# EAGLE design final2 (EAGLE 9.6.2)
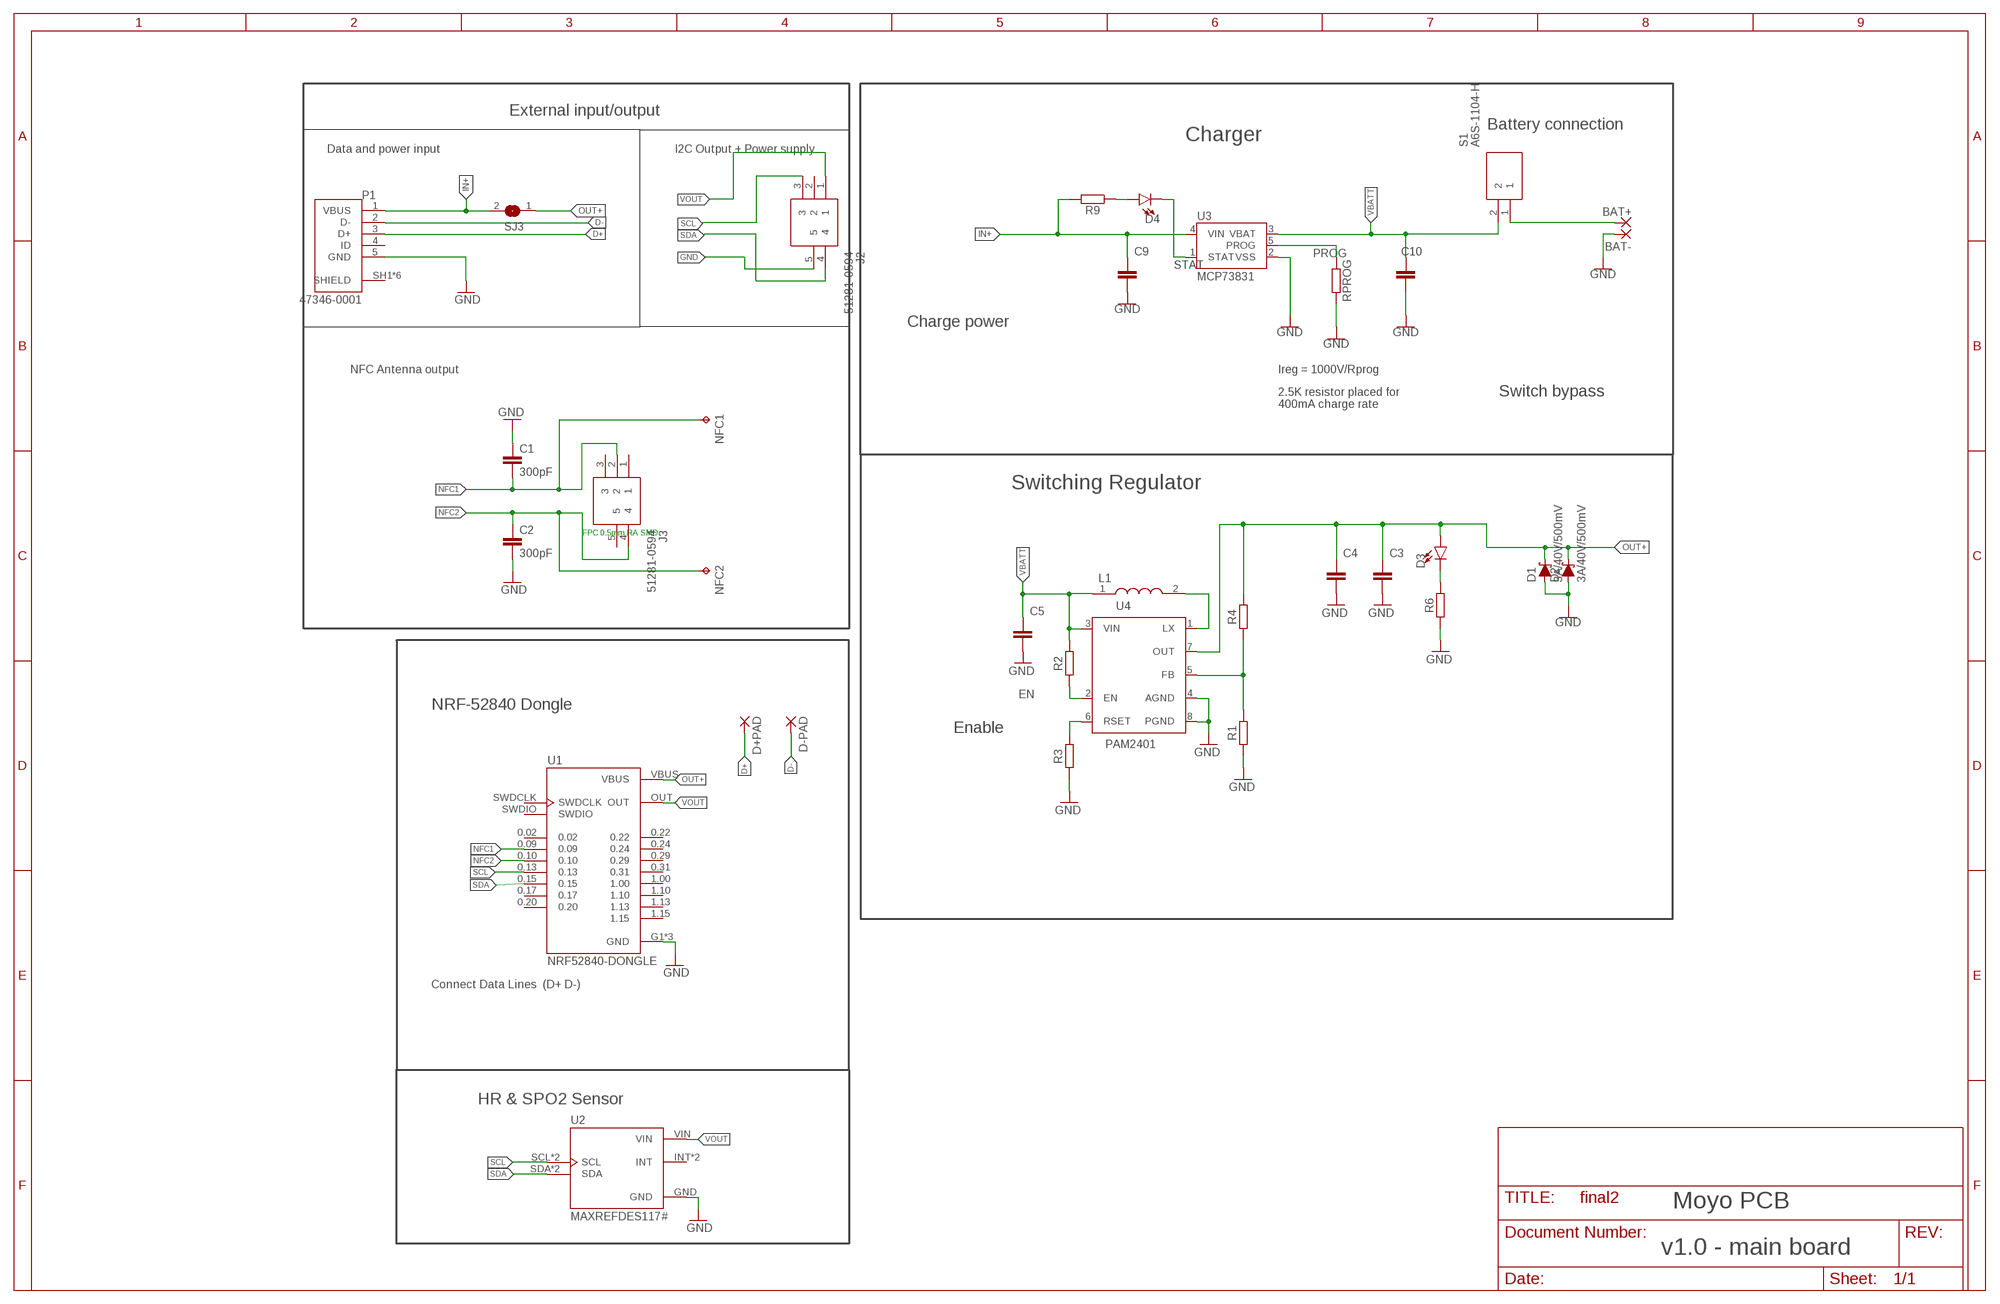
[diagram p0: schematic, sheet 1]

## Parts
BAT+  SMD5  [SMD2,54-5,08]
BAT-  SMD5  [SMD2,54-5,08]
C1  300pF  C-EUC0805  [C0805]
C2  300pF  C-EUC0805  [C0805]
C3  22uF  C-EUC0805  [C0805]
C4  22uF  C-EUC0805  [C0805]
C5  22uF  C-EUC0805  [C0805]
C9  4.7uF  C-EUC0805  [C0805]
C10  4.7uF  C-EUC0805  [C0805]
D1  3A/40V/500mV  DIODE-SCHOTTKY-B340A  [SMA-DIODE]
D2  3A/40V/500mV  DIODE-SCHOTTKY-B340A  [SMA-DIODE]
D3  RED  LEDCHIP-LED0805  [CHIP-LED0805]
D4  BLUE  LEDCHIP-LED0805  [CHIP-LED0805]
D+PAD  SMD5  [SMD2,54-5,08]
D-PAD  SMD5  [SMD2,54-5,08]
J2  51281-0594  [51281-0594]
J3  51281-0594  [51281-0594]
L1  74437324022  [WE-LHMI_402048]
NFC1  TPB1,27  [B1,27]
NFC2  TPB1,27  [B1,27]
P1  47346-0001  [MOLEX_47346-0001]
R1  68k  R-EU_M0805  [M0805]
R2  750K  R-EU_M0805  [M0805]
R3  DNP  R-EU_M0805  [M0805]
R4  470k  R-EU_M0805  [M0805]
R6  4.7k  R-EU_M0805  [M0805]
R9  1k  R-EU_M0805  [M0805]
RPROG  2.5k  R-EU_M0805  [M0805]
S1  A6S-1104-H  [A6S-1104-H]
SJ3  SJ  [SJ]
U1  NRF52840-DONGLE  [MODULE_NRF52840-DONGLE]
U2  MAXREFDES117#  [MODULE_MAXREFDES117#]
U3  MCP73831  [SOT23-5]
U4  PAM2401  [MSOP8]

## Nets
D+: D+PAD.1(P) P1.3(D+)
D-: D-PAD.1(P) P1.2(D-)
EN: R2.1 U4.2(EN)
GND: BAT-.1(P) C1.1 C2.2 C3.2 C4.2 C5.2 C9.2 C10.2 D1.A D2.A J2.5 P1.5(GND) R1.1 R3.1 R6.1 RPROG.2 U1.G1(GND) U1.G2(GND) U1.G3(GND) U2.GND U3.2(VSS) U4.4(AGND) U4.8(PGND)
IN+: C9.1 P1.1(VBUS) R9.2 SJ3.2 U3.4(VIN)
N$3: D3.C R6.2
N$4: L1.2 U4.1(LX)
N$5: D4.A R9.1
N$6: R3.2 U4.6(RSET)
N$7: BAT+.1(P) S1.1
N$12: R1.2 R4.1 U4.5(FB)
NFC1: C1.2 J3.2 NFC1.TP U1.0.09
NFC2: C2.1 J3.4 NFC2.TP U1.0.10
OUT+: C3.1 C4.1 D1.C D2.C D3.A R4.2 SJ3.1 U1.VBUS U4.7(OUT)
PROG: RPROG.1 U3.5(PROG)
SCL: J2.3 U1.0.13 U2.SCL U2.SCL1(SCL)
SDA: J2.4 U1.0.15 U2.SDA U2.SDA1(SDA)
STAT: D4.C U3.1(STAT)
VBATT: C5.1 C10.1 L1.1 R2.2 S1.2 U3.3(VBAT) U4.3(VIN)
VOUT: J2.1 U1.OUT U2.VIN
Unconnected: J2.2 J3.1 J3.3 J3.5 P1.4(ID) P1.SH1(SHIELD) P1.SH2(SHIELD) P1.SH3(SHIELD) P1.SH4(SHIELD) P1.SH5(SHIELD) P1.SH6(SHIELD) U1.0.02 U1.0.17 U1.0.20 U1.0.22 U1.0.24 U1.0.29 U1.0.31 U1.1.00 U1.1.10 U1.1.13 U1.1.15 U1.SWDCLK U1.SWDIO U2.INT U2.INT1(INT)

## Notes on the sheet
- External input/output
- Battery connection
- Charger
- Data and power input | I2C Output + Power supply
- Charge power
- NFC Antenna output | Ireg = 1000V/Rprog
- Switch bypass
- 2.5K resistor placed for
  400mA charge rate
- Switching Regulator
- FPC 0.5mm RA SMD
- NRF-52840 Dongle
- Enable
- Connect Data Lines  (D+ D-)
- HR & SPO2 Sensor
- Moyo PCB
- v1.0 - main board

## Library data of the parts
BAT+ BAT- D+PAD D-PAD = wirepad:SMD5: SMD PAD
C1-C5 C9 C10 = rcl:C-EU: CAPACITOR, European symbol; SPICEPREFIX: C
D1 D2 = SparkFun-DiscreteSemi:DIODE-SCHOTTKY: Schottky diode A Schottky diode is a semiconductor diode which has a low forward voltage drop and a very fast switching action.; PROD_ID: DIO-09886
D3 D4 = led:LED: LED OSRAM: - CHIPLED LG R971, LG N971, LY N971, LG Q971, LY Q971, LO R971, LY R971 LH N974, LH R974 LS Q976, LO Q976, LY Q976 LO Q996 - Hyper CHIPLED LW Q18S LB Q993, LB Q99A, LB R99A - SideLED LS A670, LO A670, LY A670, LG A670, LP A670 LB A673, LV A673, LT A673, LW A673 LH A674 LY A675 LS A676, LA A676, LO A676, LY A676, LW A676 LS A679, LY A679, LG A679 - Hyper Micro SIDELED® LS Y876, LA Y876, LO Y876, LY Y876 LT Y87S - SmartLED LW L88C, LW L88S LB L89C, LB L89S, LG L890 LS L89K, LO L89K, LY L89K LS L896, LA L896, LO L896, LY L896 - TOPLED LS T670, LO T670, LY T670, LG T670, LP T670 LSG T670, LSP T670, LSY T670, LOP T670, LYG T670 LG T671, LOG T671, LSG T671 LB T673, LV T673, LT T673, LW T673 LH T674 LS T676, LA T676, LO T676, LY T676, LB T676, LH T676, LSB T676, LW T676 LB T67C, LV T67C, LT T67C, LS T67K, LO T67K, LY T67K, LW E67C LS E67B, LA E67B, LO E67B, LY E67B, LB E67C, LV E67C, LT E67C LW T67C LS T679, LY T679, LG T679 LS T770, LO T770, LY T770, LG T770, LP T770 LB T773, LV T773, LT T773, LW T773 LH T774 LS E675, LA E675, LY E675, LS T675 LS T776, LA T776, LO T776, LY T776, LB T776 LHGB T686 LT T68C, LB T68C - Hyper Mini TOPLED® LB M676 - Mini TOPLED Santana® LG M470 LS M47K, LO M47K, LY M47K Source: http://www.osram.convergy.de LUXEON: - LUMILED® LXK2-PW12-R00, LXK2-PW12-S00, LXK2-PW14-U00, LXK2-PW14-V00 LXK2-PM12-R00, LXK2-PM12-S00, LXK2-PM14-U00 LXK2-PE12-Q00, LXK2-PE12-R00, LXK2-PE12-S00, LXK2-PE14-T00, LXK2-PE14-U00 LXK2-PB12-K00, LXK2-PB12-L00, LXK2-PB12-M00, LXK2-PB14-N00, LXK2-PB14-P00, LXK2-PB14-Q00 LXK2-PR12-L00, LXK2-PR12-M00, LXK2-PR14-Q00, LXK2-PR14-R00 LXK2-PD12-Q00, LXK2-PD12-R00, LXK2-PD12-S00 LXK2-PH12-R00, LXK2-PH12-S00 LXK2-PL12-P00, LXK2-PL12-Q00, LXK2-PL12-R00 Source: www.luxeon.com KINGBRIGHT: KA-3528ASYC Source: www.kingbright.com
J2 J3 = 51281-0594:51281-0594: FFC & FPC Connectors 0.5 FPC Non-ZIF 5Ckt Dual Contact Source: Datasheet <http://uk.rs-online.com/web/p/products/1791950P>; DESCRIPTION: FFC & FPC Connectors 0.5 FPC Non-ZIF 5Ckt Dual Contact; HEIGHT: mm; MANUFACTURER_NAME: Molex; MANUFACTURER_PART_NUMBER: 51281-0594; RS_PART_NUMBER: 1791950P; RS_PRICE-STOCK: http://uk.rs-online.com/web/p/products/1791950P
L1 = 74437324022:74437324022: SMD Power Inductor WE-LHMI Source: Datasheet <http://uk.rs-online.com/web/p/products/7568465P>; DESCRIPTION: SMD Power Inductor WE-LHMI; HEIGHT: mm; MANUFACTURER_NAME: Wurth Elektronik; MANUFACTURER_PART_NUMBER: 74437324022; RS_PART_NUMBER: 7568465P; RS_PRICE-STOCK: http://uk.rs-online.com/web/p/products/7568465P
NFC1 NFC2 = testpad:TP: Test pad
P1 = 47346-0001:47346-0001: CONN RCPT 5POS MICRO USB R/A SMD Check prices <https://pricing.snapeda.com/parts/47346-0001/Molex/view-part?ref=eda>; AVAILABILITY: Warning; DESCRIPTION: USB - micro B USB 2.0 Receptacle Connector 5 Position Surface Mount, Right Angle; MF: Molex; MP: 47346-0001; PACKAGE: None; PRICE: None; PURCHASE-URL: https://pricing.snapeda.com/search/part/47346-0001/?ref=eda
R1-R4 R6 R9 RPROG = rcl:R-EU_: RESISTOR, European symbol; SPICEPREFIX: R
S1 = A6S-1104-H:A6S-1104-H: DIP Switches / SIP Switches Dip Switch Source: Datasheet <http://uk.rs-online.com/web/p/products/6820986P>; ALLIED_NUMBER: 70354967; DESCRIPTION: DIP Switches / SIP Switches Dip Switch; HEIGHT: mm; MANUFACTURER_NAME: Omron Electronics; MANUFACTURER_PART_NUMBER: A6S-1104-H; RS_PART_NUMBER: 6820986P; RS_PRICE-STOCK: http://uk.rs-online.com/web/p/products/6820986P
SJ3 = jumper:SJ: SMD solder JUMPER
U1 = NRF52840-DONGLE:NRF52840-DONGLE: NRF52840 Bluetooth-5/Thread/802.15.4/ANT/2.4GHz Multiprotocol SoC USB Development Dongle Buy Part <https://snapeda.com/parts/NRF52840-DONGLE/Nordic%20Semiconductor/view-part/?ref=eda>; AVAILABILITY: Warning; DESCRIPTION: - Transceiver; Bluetooth® 5 For Use With nRF52840; DIGIKEY-PURCHASE-URL: https://snapeda.com/shop?store=DigiKey&id=2873714; MF: Nordic Semiconductor; MOUSER-PURCHASE-URL: https://snapeda.com/shop?store=Mouser&id=2873714; MP: NRF52840-DONGLE; PACKAGE: None; PRICE: None
U2 = MAXREFDES117_:MAXREFDES117#: MAX1921, MAX14595, MAX30102 - Medical, Pulse Oximeter (PO or SpO2) Sensor Evaluation Board Buy Part <https://snapeda.com/parts/MAXREFDES117%23/Maxim%20Integrated/view-part/?ref=eda>; AVAILABILITY: Warning; DESCRIPTION: MAX1921, MAX14595, MAX30102 - Medical, Pulse Oximeter (PO or SpO2) Sensor Evaluation Board; MF: Maxim Integrated; MOUSER-PURCHASE-URL: https://snapeda.com/shop?store=Mouser&id=585423; MP: MAXREFDES117#; PACKAGE: None; PRICE: None
U3 = SparkFun-IC-Power:MCP73831: MCP73831T Li-Ion, Li-Pol Controller Miniature single cell, fully integrated Li-Ion, Li-polymer charge management controller Datasheet <http://ww1.microchip.com/downloads/en/DeviceDoc/20001984g.pdf> SparkFun Products: SparkFun ESP32 Thing <https://www.sparkfun.com/products/13907> SparkFun 9DoF Razor IMU M0 <https://www.sparkfun.com/products/14001>; PROD_ID: IC-09995
U4 = SparkFun-IC-Power:PAM2401: PAM2401 - Boost PMIC Specifications: Up to 1A output current 0.9V to 4.75V Input Range 2.5V to 5.0V Adjustable Output Voltage Datasheet <https://www.diodes.com/assets/Datasheets/PAM2401.pdf> (Diodes inc.); PROD_ID: IC-13769

## Net classes
0 default: width 0.152 mm, drill 0.305 mm, clearance 0.152 mm

## Board
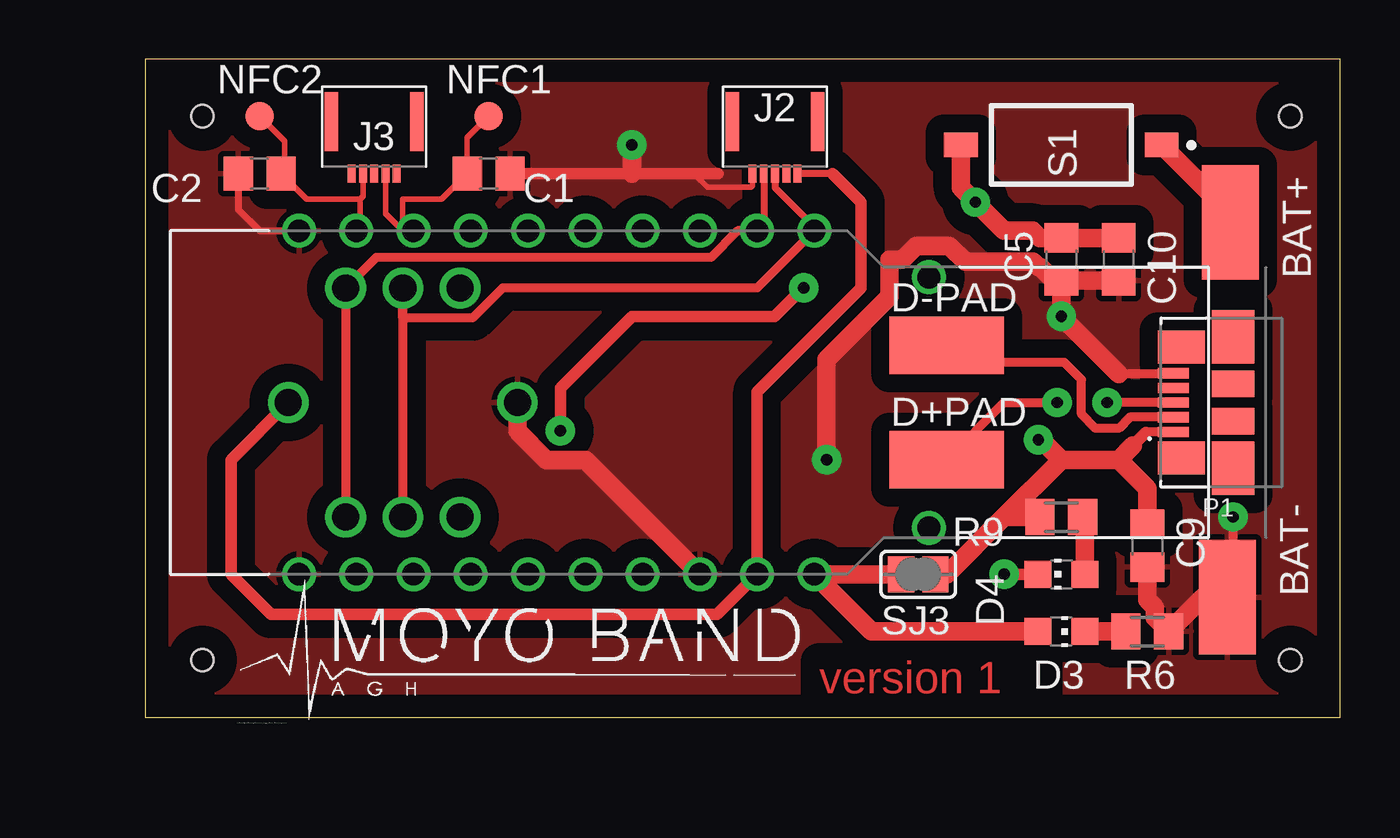
[diagram p1: board, top side]
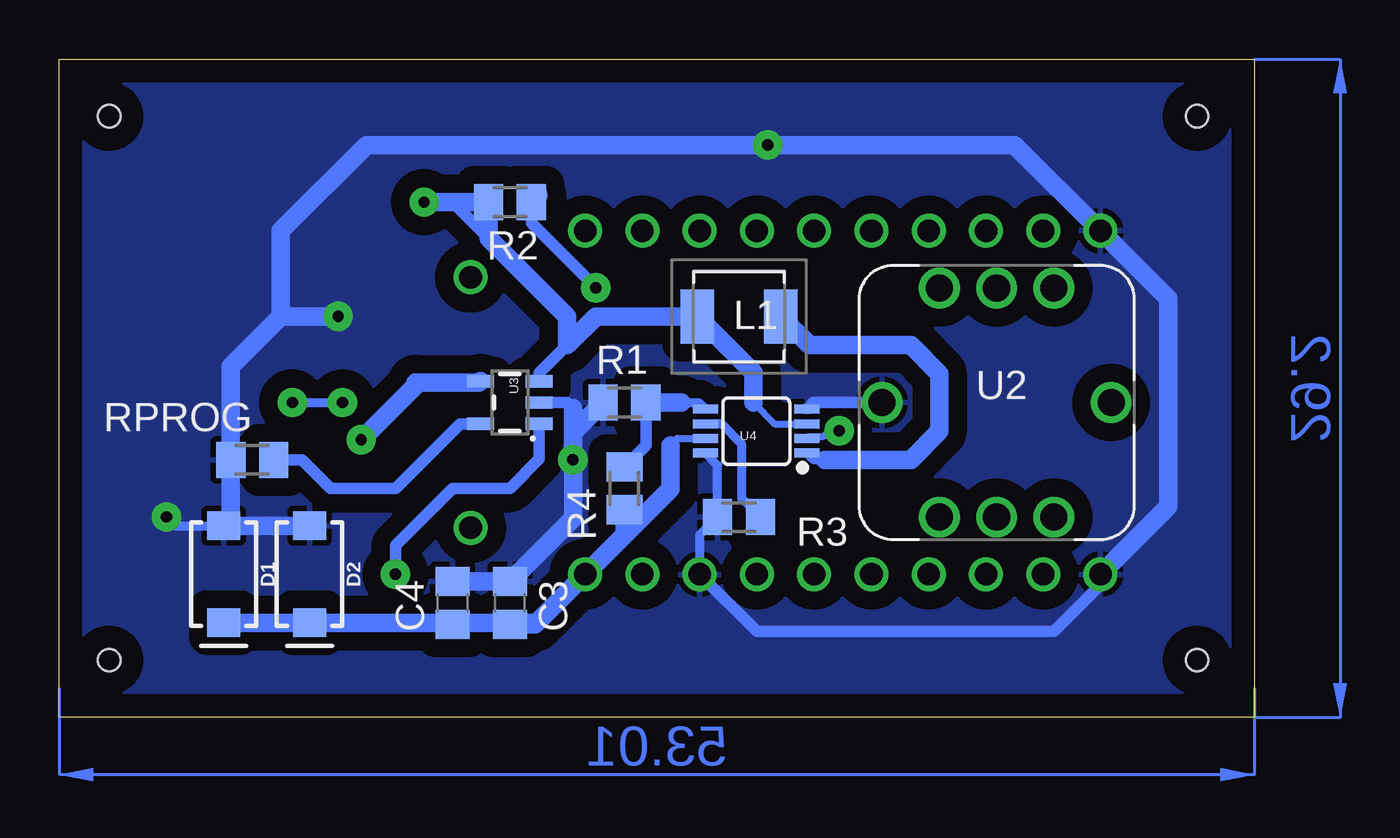
[diagram p2: board, bottom side, seen from below]

Size 53.01 x 29.2 mm. Coordinates in mm from the lower left corner, seen from the top.
Outline: 0,0 53.01,0 53.01,29.2 0,29.2 0,0
Copper layers (1*16): Top 0.035mm / dielectric 1.5mm / Bottom 0.035mm
Design rules "default *": minimum track width 10mil, minimum drill 0.5mm, track to track 9mil, track to pad 9mil, pad to pad 9mil, via to via 9mil, smd to smd 9mil, copper to edge 40mil, drill to drill 8mil, minimum pad ring 10mil, minimum via ring 8mil, stop-mask expansion 4mil, vias tented up to drill 0mil, thermal gap 10mil
Holes 1 mm at 2.54,2.54 2.54,26.67 50.8,26.67 50.8,2.54

### Footprints (pad centres in the part's own frame; a part is rotated, then mirrored left to right if it is on the bottom)
SMD2,54-5,08 = smd 2.54 x 5.08: 1 0,0
C0805 = smd 1.3 x 1.5: 1 -0.95,0; 2 0.95,0
SMA-DIODE = smd 1.27 x 1.47: A -2.15,0; C 2.15,0
CHIP-LED0805 = smd 1.2 x 1.2: A 0,-1.05; C 0,1.05
51281-0594 = smd 0.35 x 0.8: 1 -1,0; 2 -0.5,0; 3 0,0; 4 0.5,0; 5 1,0 | smd 0.6 x 2.6: 6 -1.9,-2.3; 7 1.9,-2.3
WE-LHMI_402048 = smd 1.5 x 2.4: 1 -1.85,0; 2 1.85,0
B1,27 = smd 1.27 x 1.27: TP 0,0
MOLEX_47346-0001 = smd 0.45 x 1.38: 1 -1.3,2.66; 2 -0.65,2.66; 3 0,2.66; 4 0.65,2.66; 5 1.3,2.66 | smd 1.475 x 2.1: SH1 -2.462,2.3; SH2 2.462,2.3 | smd 2.375 x 1.9: SH3 -2.913,0; SH6 2.913,0 | smd 1.175 x 1.9: SH4 -0.838,0; SH5 0.838,0
M0805 = smd 1.3 x 1.6: 1 -0.95,0; 2 0.95,0
A6S-1104-H = smd 1.1 x 1.5: 1 0,-4.45; 2 0,4.45
SJ = smd 1.168 x 1.6: 1 -0.762,0; 2 0.762,0
MODULE_NRF52840-DONGLE = drill 1: 0.02 -7.145,-7.62; 0.09 -12.225,7.62; 0.10 -14.765,7.62; 0.13 5.555,7.62; 0.15 3.015,7.62; 0.17 0.475,7.62; 0.20 -2.065,7.62; 0.22 -4.605,7.62; 0.24 -7.145,7.62; 0.29 -4.605,-7.62; 0.31 -2.065,-7.62; 1.00 -9.685,7.62; 1.10 -14.765,-7.62; 1.13 -12.225,-7.62; 1.15 -9.685,-7.62; G1 -17.305,7.62; G2 -17.305,-7.62; G3 0.475,-7.62; OUT 3.015,-7.62; SWDCLK 10.635,-5.56; SWDIO 10.635,5.56; VBUS 5.555,-7.62
MODULE_MAXREFDES117# = drill 1.2: GND -5.08,0; INT -2.54,5.08; INT1 -2.54,-5.08; SCL 0,5.08; SCL1 0,-5.08; SDA 2.54,5.08; SDA1 2.54,-5.08; VIN 5.08,0
SOT23-5 = smd 0.55 x 1.2: 1 -0.95,-1.3; 2 0,-1.3; 3 0.95,-1.3; 4 0.95,1.3; 5 -0.95,1.3
MSOP8 = smd 0.4 x 1.1: 1 -0.975,-2.25; 2 -0.325,-2.25; 3 0.325,-2.25; 4 0.975,-2.25; 5 0.975,2.25; 6 0.325,2.25; 7 -0.325,2.25; 8 -0.975,2.25

### Placement (x,y rotation side)
BAT+  48.13,21.97 0 top
BAT-  48.01,5.33 0 top
C1  15.24,24.13 180 top
C2  5.08,24.13 180 top
C3  33.02,5.08 90 bottom
C4  35.56,5.08 90 bottom
C5  40.64,20.32 270 top
C9  44.45,7.62 270 top
C10  43.18,20.32 270 top
D1  45.72,6.35 270 bottom
D2  41.91,6.35 270 bottom
D3  40.64,3.81 270 top
D4  40.64,6.35 90 top
D+PAD  35.56,11.43 270 top
D-PAD  35.56,16.51 270 top
J2  27.94,24.13 180 top
J3  10.16,24.13 180 top
L1  22.86,17.78 0 bottom
NFC1  15.24,26.67 0 top
NFC2  5.08,26.67 0 top
P1  48.26,13.97 90 top
R1  27.94,13.97 0 bottom
R2  33.02,22.86 180 bottom
R3  22.86,8.89 0 bottom
R4  27.94,10.16 270 bottom
R6  44.45,3.81 180 top
R9  40.64,8.89 180 top
RPROG  44.45,11.43 180 bottom
S1  40.64,25.4 90 top
SJ3  34.29,6.35 0 top
U1  24.13,13.97 0 top
U2  11.43,13.97 0 bottom
U3  33.02,13.97 90 bottom
U4  22.1,12.7 90 bottom

### Tracks (layer width: path | path; a pad name or v marks a point on that pad's centre or on a via)
D+  (via drill 0.5 pad 1.3)
  Top 0.406: P1.3 v42.67,13.97 | D+PAD.1 38.1,13.97 v40.45,13.97
  Bottom 0.406: v42.67,13.97 v40.45,13.97
D-
  Top 0.406: P1.2 43.67,13.32 43.18,12.83 42.16,12.83 41.53,13.46 41.53,14.99 40.77,15.75 36.32,15.75 D-PAD.1
EN  (via drill 0.5 pad 1.3)
  Top 0.508: v18.42,12.71 18.42,14.61 21.59,17.78 27.93,17.78 v29.21,19.07
  Bottom 0.305: U4.2 19.78,12.44 19.14,12.44 18.87,12.71 v18.42,12.71
  Bottom 0.508: v29.21,19.07 32.07,21.93 R2.1
  Bottom 0.813: R2.1 31.75,23.18
GND  (via drill 0.5 pad 1.3)
  Top 0.254: J2.5 26.94,23.59 26.87,23.52 24.94,23.52 24.33,24.13
  Top 0.305: C2.2 4.13,22.54 5.08,21.59 U1.G1
  Top 0.406: P1.5 45.57,15.24 43.18,15.24 | BAT-.1 48.26,5.59 v48.26,8.89
  Top 0.508: C1.1 21.59,24.13 24.33,24.13 25.4,24.13
  Top 0.813: C10.2 C5.2 40.64,19.05 | 40.64,19.05 v40.64,17.8 40.64,17.78 43.18,15.24 | C9.2 44.45,5.21 44.78,4.87 44.78,4.42 R6.1 46.92,5.33 BAT-.1 | U1.G3 19.53,11.43 17.78,11.43 16.51,12.7 U2.GND | v21.59,25.4 21.59,24.13 | v30.23,11.43 30.23,15.88 33.02,18.68 33.02,20.32 33.59,20.32 34.19,20.92 35.68,20.92 36.37,20.23 39.38,20.23 39.63,19.98 39.7,19.98 40.64,19.05
  Bottom 0.305: 19.85,13.71 U4.4
  Bottom 0.406: U1.G3 24.61,8.1 R3.1 23.81,11.19 U4.8 | v48.26,8.89 47.87,8.5 D1.A
  Bottom 0.508: 30.23,13.72 30.48,13.97 U3.2 | U2.GND 19.55,13.97 19.82,13.71 19.85,13.71 | U1.G3 22.07,3.81 8.89,3.81 6.83,5.88 U1.G2
  Bottom 0.813: v40.64,17.8 40.65,17.78 43.18,17.78 | C4.2 C3.2 30.23,8.82 v30.23,11.43 | v30.23,11.43 30.23,12.7 | 30.23,12.7 30.23,13.72 | D2.A D1.A 45.4,8.82 RPROG.2 45.4,15.56 43.18,17.78 | 30.23,12.7 30.16,12.7 R1.1 30.23,12.63 v30.23,11.43 | U1.G2 3.81,9.37 3.81,18.57 U1.G1 10.63,25.4 v21.59,25.4 39.37,25.4 43.18,21.59 43.18,17.78
  pour Bottom (isolate 0.813): -10.16,31.75 -10.16,-5.08 58.42,-5.08 58.42,31.75
  pour Top (isolate 0.813): -8.89,34.29 -8.89,-5.08 60.96,-5.08 60.96,34.29
IN+  (via drill 0.5 pad 1.3)
  Top 0.254: P1.1 45.56,12.63
  Top 0.406: P1.1 44.38,12.67 44.38,12.63
  Top 0.508: 44.38,12.63 43.81,12.06
  Top 0.813: 43.18,11.43 43.81,12.06 | 40.64,11.43 43.18,11.43 | 38.1,8.89 40.64,11.43 | 38.1,8.89 35.56,6.35 SJ3.2 | R9.2 38.1,8.89 | 43.18,11.43 44.45,10.16 C9.1 | 40.64,11.43 39.75,12.32 v39.62,12.32
  Bottom 0.813: U3.4 34.38,14.86 37.21,14.86 37.21,14.73 v39.62,12.32
N$3
  Top 0.813: D3.C R6.2
N$4
  Bottom 0.406: 19.05,11.43 19.55,11.43 U4.1
  Bottom 0.813: L1.2 19.74,16.51 15.24,16.51 13.97,15.24 13.97,12.7 15.24,11.43 19.05,11.43
N$5
  Top 0.813: R9.1 41.69,8.79 D4.A
N$6
  Bottom 0.406: R3.2 22.73,9.71 22.73,12.12 23.62,13.01 24.33,13.01 U4.6
N$7
  Top 0.813: BAT+.1 48.13,22.36 S1.1
N$12
  Bottom 0.406: 25.4,13.97 24.64,13.97 U4.5
  Bottom 0.508: R4.1 26.99,12.06 R1.2
  Bottom 0.813: R1.2 25.4,13.97
NFC1
  Top 0.254: 11.43,22.07 11.43,21.59 10.66,22.36 J3.2 | 11.43,22.07 11.43,22.86 11.43,22.99 13.15,22.99 C1.2 14.29,25.72 NFC1.TP | 11.43,22.07 U1.0.09
NFC2
  Top 0.254: C2.1 6.19,23.97 | 6.19,23.97 7.17,22.99 9.53,22.99 | 9.53,22.99 9.53,21.75 U1.0.10 | 9.53,22.99 9.66,23.12 J3.4 | NFC2.TP 6.19,25.56 6.19,23.97
OUT+
  Top 0.813: D3.A 32.22,3.81 U1.VBUS SJ3.1
  Bottom 0.254: C4.1 C3.1
  Bottom 0.305: 25.91,12.06 25.6,12.38 U4.7
  Bottom 0.813: D1.C D2.C 31.83,4.2 U1.VBUS | U1.VBUS 27.94,8.1 | 27.94,8.1 R4.2 | 27.94,8.1 25.91,10.13 25.91,12.06 | U1.VBUS 31.9,4.13 C3.1
PROG
  Bottom 0.508: U3.5 35.24,13.02 38.1,10.16 40.97,10.16 42.24,11.43 RPROG.1
SCL
  Top 0.305: J2.3 27.94,23.5 29.68,21.75 U1.0.13
  Top 0.406: U1.0.13 27.14,19.05 15.85,19.05 14.52,17.72 11.43,17.72 U2.SCL U2.SCL1
SDA
  Top 0.305: J2.4 27.44,21.89 U1.0.15
  Top 0.406: U2.SDA1 U2.SDA 10.24,20.4 25.1,20.4 26.28,21.59 U1.0.15
STAT  (via drill 0.5 pad 1.3)
  Top 0.508: v38.1,6.35 D4.C 39.37,6.35
  Bottom 0.508: v38.1,6.35 38.1,7.62 35.56,10.16 33.02,10.16 31.72,11.46 U3.1
VBATT  (via drill 0.5 pad 1.3)
  Top 0.813: C10.1 C5.1 39.69,21.27 39.37,21.59 38.1,21.59 v36.83,22.86 36.19,23.5 S1.2
  Bottom 0.305: 22.23,13.97 21.28,13.03 U4.3
  Bottom 0.508: U3.3 31.72,15.27 30.48,16.51 | v36.83,22.86 35.56,22.86 33.97,21.27
  Bottom 0.813: 22.23,13.97 22.23,15.29 L1.1 29.21,17.78 30.48,16.51 30.48,17.78 33.97,21.27 R2.2 v36.83,22.86
VOUT
  Top 0.305: 30.48,24.13 J2.1
  Top 0.508: 30.48,24.13 31.75,22.86 31.75,19.05 27.14,14.45 U1.OUT 25.37,4.57 5.59,4.57 3.81,6.35 3.81,11.43 U2.VIN
(copper drawn outside any net)
  shapes: Bottom area x2

### Text on the board
Top: version 1
tNames: C:/Users/Acer/Desktop/Graphics_Logo_Moyo_Band_logo.bmp